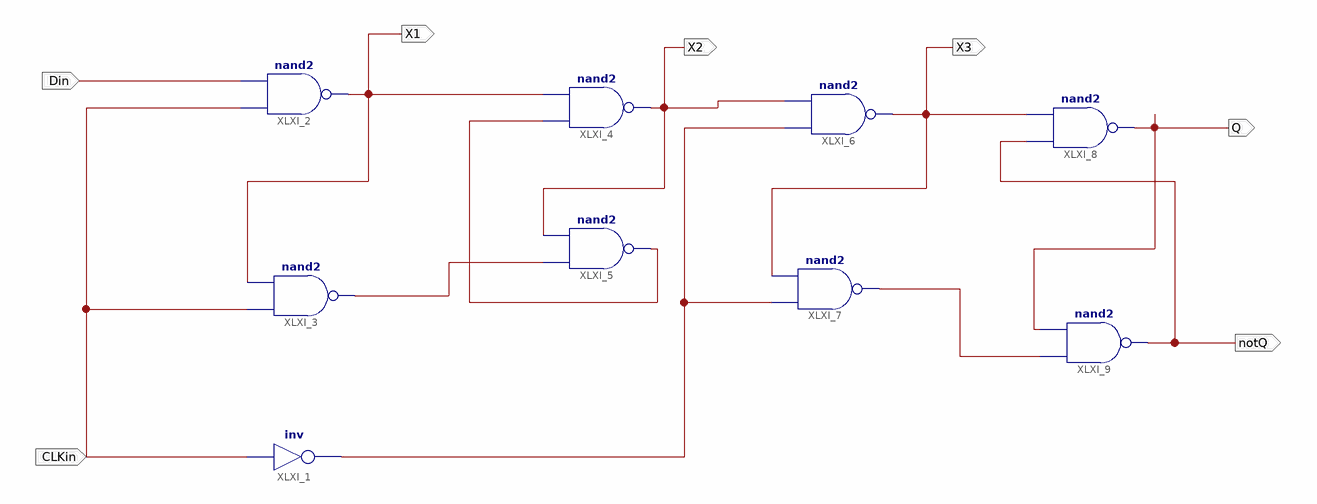
[diagram p0: schematic sheet 1]
// Xilinx ISE schematic lab7_experiment5.sch (spartan3e) as structural Verilog: 9 symbols, 7 ports
module lab7_experiment5 (
  input  CLKin,
  input  Din,
  output Q,
  output notQ,
  output X1,
  output X2,
  output X3
);

  wire XLXN_7, XLXN_13, XLXN_14, XLXN_19;

  not XLXI_1 (XLXN_19, CLKin);
  nand XLXI_2 (X1, CLKin, Din);
  nand XLXI_3 (XLXN_13, CLKin, X1);
  nand XLXI_4 (X2, XLXN_14, X1);
  nand XLXI_5 (XLXN_14, XLXN_13, X2);
  nand XLXI_6 (X3, XLXN_19, X2);
  nand XLXI_7 (XLXN_7, XLXN_19, X3);
  nand XLXI_8 (Q, notQ, X3);
  nand XLXI_9 (notQ, XLXN_7, Q);
endmodule
